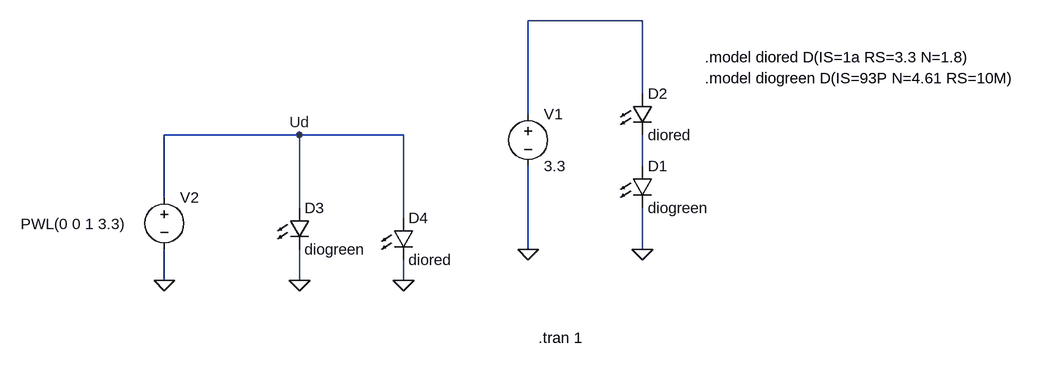
[diagram p0: schematic Led_and_Poti.asc]
Led_and_Poti.asc, the LTspice schematic file:
Version 4
SHEET 1 1376 680
WIRE 128 -16 -48 -16
WIRE 128 96 128 -16
WIRE -48 128 -48 -16
WIRE -400 160 -608 160
WIRE -240 160 -400 160
WIRE 128 208 128 160
WIRE -608 256 -608 160
WIRE -400 272 -400 160
WIRE -240 288 -240 160
WIRE -48 336 -48 208
WIRE 128 336 128 272
WIRE -608 384 -608 336
WIRE -400 384 -400 336
WIRE -240 384 -240 352
FLAG 128 336 0
FLAG -48 336 0
FLAG -608 384 0
FLAG -400 384 0
FLAG -400 160 Ud
FLAG -240 384 0
SYMBOL LED 112 208 R0
SYMATTR InstName D1
SYMATTR Value diogreen
SYMBOL LED 112 96 R0
SYMATTR InstName D2
SYMATTR Value diored
SYMBOL voltage -48 112 R0
WINDOW 123 0 0 Left 0
WINDOW 39 0 0 Left 0
SYMATTR InstName V1
SYMATTR Value 3.3
SYMBOL LED -416 272 R0
SYMATTR InstName D3
SYMATTR Value diogreen
SYMBOL voltage -608 240 R0
WINDOW 3 -221 57 Left 2
WINDOW 123 0 0 Left 0
WINDOW 39 0 0 Left 0
SYMATTR InstName V2
SYMATTR Value PWL(0 0 1 3.3)
SYMBOL LED -256 288 R0
SYMATTR InstName D4
SYMATTR Value diored
TEXT 224 40 Left 2 !.model diored D(IS=1a RS=3.3 N=1.8)
TEXT 224 72 Left 2 !.model diogreen D(IS=93P N=4.61 RS=10M)
TEXT -32 472 Left 2 !.tran 1

The netlist it stands for:
* Led_and_Poti.asc
D1 N002 0 diogreen
D2 N001 N002 diored
V1 N001 0 3.3
D3 Ud 0 diogreen
V2 Ud 0 PWL(0 0 1 3.3)
D4 Ud 0 diored
.model D D
.lib standard.dio
.model diored D(IS=1a RS=3.3 N=1.8)
.model diogreen D(IS=93P N=4.61 RS=10M)
.tran 1
.backanno
.end